# EAGLE design Auto_wiper (EAGLE 6.4)
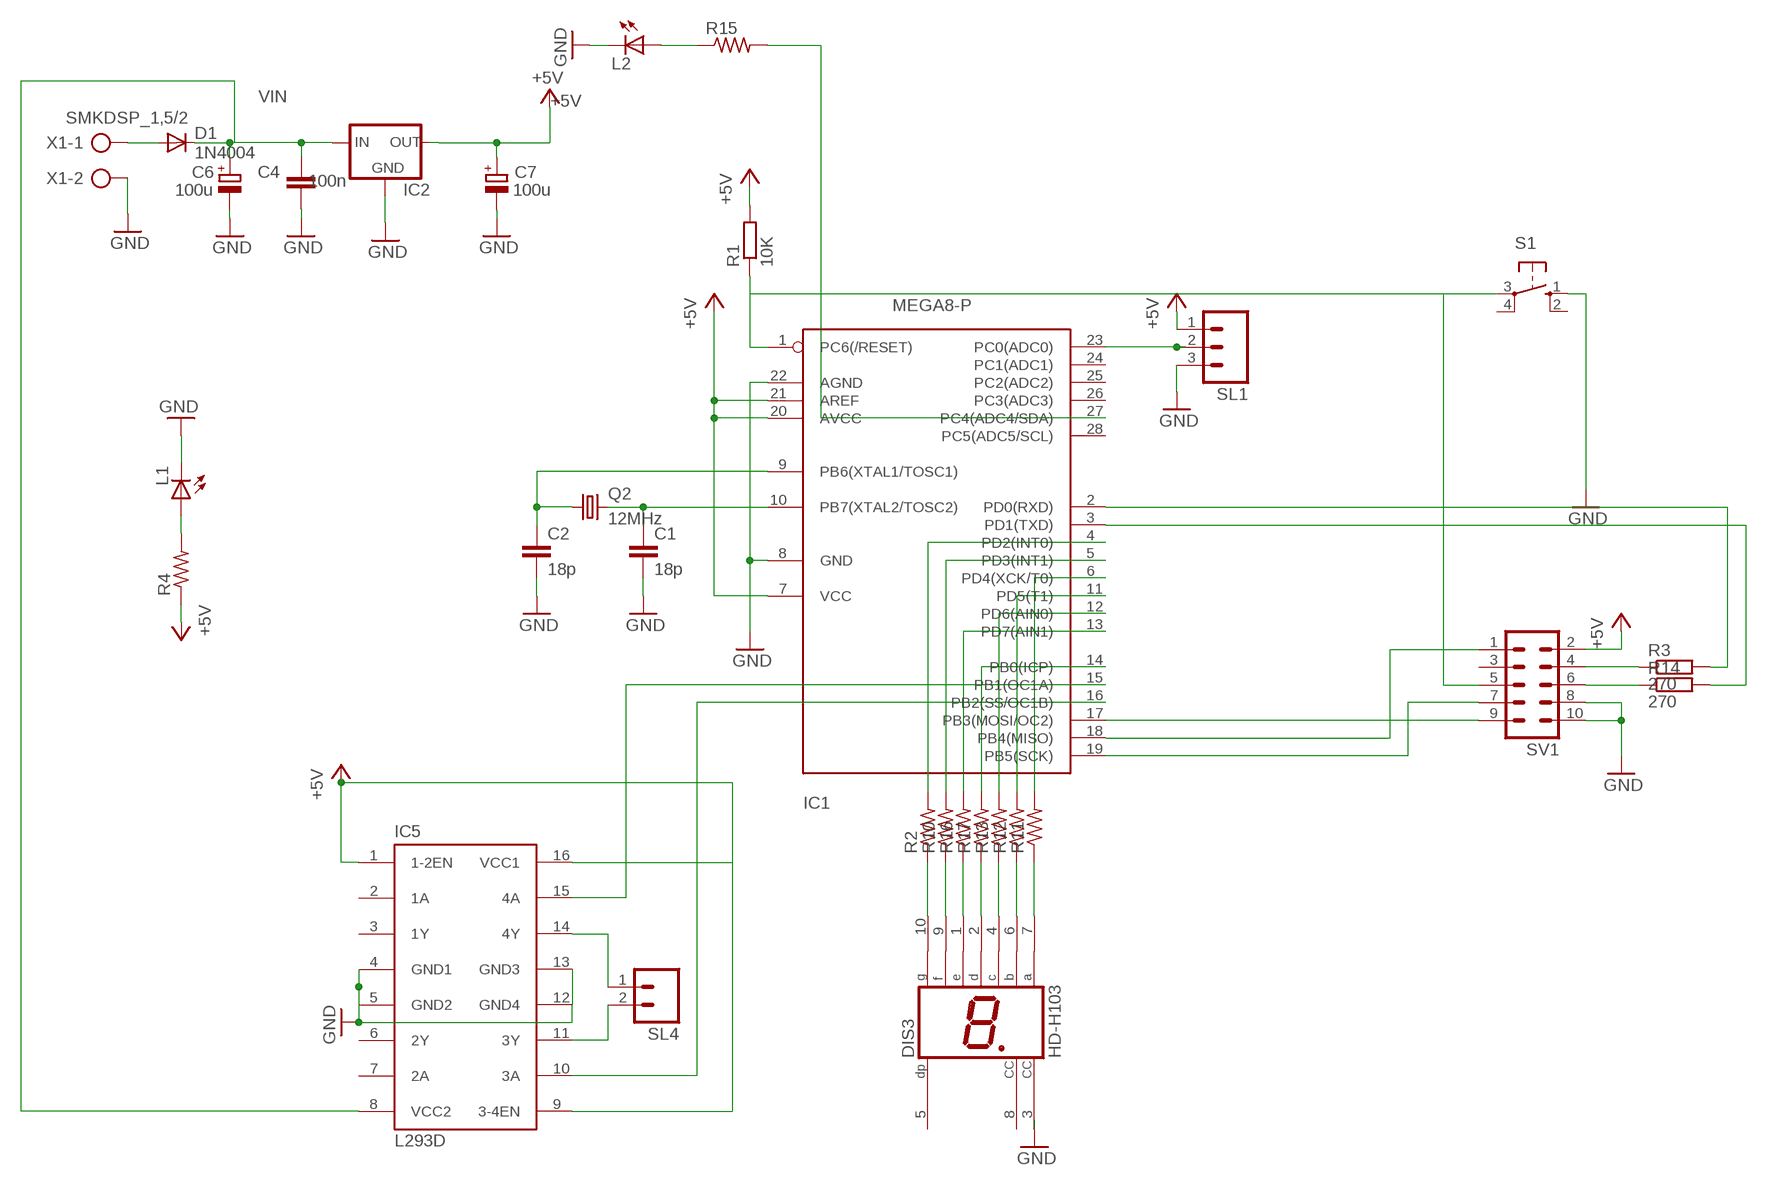
[diagram p0: schematic, sheet 1]

## Parts
C1  18p  C-EU025-024X044  [C025-024X044]
C2  18p  C-EU025-024X044  [C025-024X044]
C4  100n  C-EU025-030X050  [C025-030X050]
C6  100u  CPOL-EUE3.5-8  [E3,5-8]
C7  100u  CPOL-EUE3.5-8  [E3,5-8]
D1  1N4004  [DO41-10]
DIS3  HD-H103  [HDSP-M]
IC1  MEGA8-P  [DIL28-3]
IC2  78XXS  [78XXS]
IC5  L293D  [DIL16]
L1  LED5MM  [LED5MM]
L2  LED5MM  [LED5MM]
Q2  12MHz  CRYTALHC49S  [HC49/S]
R1  10K  R-EU_0207/10  [0207/10]
R2  R-US_0207/10  [0207/10]
R3  270  R-EU_0207/10  [0207/10]
R4  R-US_0207/10  [0207/10]
R10  R-US_0207/10  [0207/10]
R11  R-US_0207/10  [0207/10]
R12  R-US_0207/10  [0207/10]
R13  R-US_0207/10  [0207/10]
R14  270  R-EU_0207/10  [0207/10]
R15  R-US_0207/10  [0207/10]
R16  R-US_0207/10  [0207/10]
R17  R-US_0207/10  [0207/10]
S1  10-XX  [B3F-10XX]
SL1  M03  [03P]
SL4  M02  [02P]
SV1  ML10  [ML10]
X1  SMKDSP_1,5/2  [SMKDSP_1,5/2]

## Nets
+5V: C7.+ IC1.7(VCC) IC1.20(AVCC) IC1.21(AREF) IC2.OUT IC5.1(1-2EN) IC5.9(3-4EN) IC5.16(VCC1) R1.2 R4.1 SL1.1 SV1.2
GND: C1.2 C2.2 C4.1 C6.- C7.- DIS3.3(CC) IC1.8(GND) IC1.22(AGND) IC2.GND IC5.4(GND1) IC5.5(GND2) IC5.12(GND4) IC5.13(GND3) L1.K(C) L2.K(C) S1.1(S) SL1.3 SV1.8 SV1.10 X1.2
MOTOR1: IC1.15(PB1(OC1A)) IC5.15(4A)
MOTOR9: IC1.17(PB3(MOSI/OC2)) SV1.9
N$1: L1.A R4.2
N$2: IC1.19(PB5(SCK)) SV1.7
N$3: C1.1 IC1.10(PB7(XTAL2/TOSC2)) Q2.2
N$4: C2.1 IC1.9(PB6(XTAL1/TOSC1)) Q2.1
N$5: DIS3.10(G) R2.1
N$6: R3.1 SV1.4
N$7: IC1.2(PD0(RXD)) R3.2
N$8: IC1.3(PD1(TXD)) R14.2
N$9: DIS3.9(F) R10.1
N$10: IC1.27(PC4(ADC4/SDA)) R15.2
N$11: IC1.18(PB4(MISO)) SV1.1
N$12: DIS3.6(B) R12.1
N$13: IC1.1(PC6(/RESET)) R1.1 S1.3(P) SV1.5
N$14: DIS3.1(E) R16.1
N$15: DIS3.4(C) R13.1
N$16: DIS3.2(D) R17.1
N$17: DIS3.7(A) R11.1
N$18: IC1.11(PD5(T1)) R12.2
N$19: IC1.6(PD4(XCK/T0)) R11.2
N$20: IC1.5(PD3(INT1)) R10.2
N$21: IC1.4(PD2(INT0)) R2.2
N$22: IC1.23(PC0(ADC0)) SL1.2
N$23: IC1.16(PB2(SS/OC1B)) IC5.10(3A)
N$27: R14.1 SV1.6
N$30: L2.A R15.1
N$34: IC1.14(PB0(ICP)) R17.2
N$35: IC1.12(PD6(AIN0)) R13.2
N$36: IC1.13(PD7(AIN1)) R16.2
N$39: IC5.14(4Y) SL4.1
N$40: IC5.11(3Y) SL4.2
PWRIN [power]: D1.A X1.1
VIN [power]: C4.2 C6.+ D1.C IC2.IN IC5.8(VCC2)
Unconnected: DIS3.5(DP) DIS3.8(CC) IC1.24(PC1(ADC1)) IC1.25(PC2(ADC2)) IC1.26(PC3(ADC3)) IC1.28(PC5(ADC5/SCL)) IC5.2(1A) IC5.3(1Y) IC5.6(2Y) IC5.7(2A) S1.2(S1) S1.4(P1) SV1.3

## Library data of the parts
C1 C2 = rcl:C-EU: CAPACITOR, European symbol
C4 = resistor:C-EU: CAPACITOR, European symbol
C6 C7 = resistor:CPOL-EU: POLARIZED CAPACITOR, European symbol
D1 = diode:1N4004: DIODE general purpose rectifier, 1 A
DIS3 = display-hp:HD-H103: LED DISPLAY 1-character 7 segment, decimal point right; OC_FARNELL: unknown; OC_NEWARK: unknown
IC1 = atmel:MEGA8-P: MICROCONTROLLER 8 Kbytes FLASH 1 kbytes SRAM 512 bytes EEPROM USART 4-channel 10 bit ADC 2-channel 8 bit ADC Source: avr.lbr
IC2 = v-reg:78XXS: VOLTAGE REGULATOR
IC5 = st-microelectronics:L293D: PUSH-PULL 4 CHANNEL DRIVER; MPN: L293D; OC_FARNELL: 9589619; OC_NEWARK: 56P8249
L1 L2 = led:LED: LED OSRAM: - CHIPLED LG R971, LG N971, LY N971, LG Q971, LY Q971, LO R971, LY R971 LH N974, LH R974 LS Q976, LO Q976, LY Q976 LO Q996 - Hyper CHIPLED LW Q18S LB Q993, LB Q99A, LB R99A - SideLED LS A670, LO A670, LY A670, LG A670, LP A670 LB A673, LV A673, LT A673, LW A673 LH A674 LY A675 LS A676, LA A676, LO A676, LY A676, LW A676 LS A679, LY A679, LG A679 - Hyper Micro SIDELED® LS Y876, LA Y876, LO Y876, LY Y876 LT Y87S - SmartLED LW L88C, LW L88S LB L89C, LB L89S, LG L890 LS L89K, LO L89K, LY L89K LS L896, LA L896, LO L896, LY L896 - TOPLED LS T670, LO T670, LY T670, LG T670, LP T670 LSG T670, LSP T670, LSY T670, LOP T670, LYG T670 LG T671, LOG T671, LSG T671 LB T673, LV T673, LT T673, LW T673 LH T674 LS T676, LA T676, LO T676, LY T676, LB T676, LH T676, LSB T676, LW T676 LB T67C, LV T67C, LT T67C, LS T67K, LO T67K, LY T67K, LW E67C LS E67B, LA E67B, LO E67B, LY E67B, LB E67C, LV E67C, LT E67C LW T67C LS T679, LY T679, LG T679 LS T770, LO T770, LY T770, LG T770, LP T770 LB T773, LV T773, LT T773, LW T773 LH T774 LS E675, LA E675, LY E675, LS T675 LS T776, LA T776, LO T776, LY T776, LB T776 LHGB T686 LT T68C, LB T68C - Hyper Mini TOPLED® LB M676 - Mini TOPLED Santana® LG M470 LS M47K, LO M47K, LY M47K Source: http://www.osram.convergy.de LUXEON: - LUMILED® LXK2-PW12-R00, LXK2-PW12-S00, LXK2-PW14-U00, LXK2-PW14-V00 LXK2-PM12-R00, LXK2-PM12-S00, LXK2-PM14-U00 LXK2-PE12-Q00, LXK2-PE12-R00, LXK2-PE12-S00, LXK2-PE14-T00, LXK2-PE14-U00 LXK2-PB12-K00, LXK2-PB12-L00, LXK2-PB12-M00, LXK2-PB14-N00, LXK2-PB14-P00, LXK2-PB14-Q00 LXK2-PR12-L00, LXK2-PR12-M00, LXK2-PR14-Q00, LXK2-PR14-R00 LXK2-PD12-Q00, LXK2-PD12-R00, LXK2-PD12-S00 LXK2-PH12-R00, LXK2-PH12-S00 LXK2-PL12-P00, LXK2-PL12-Q00, LXK2-PL12-R00 Source: www.luxeon.com KINGBRIGHT: KA-3528ASYC Source: www.kingbright.com
Q2 = crystal:CRYTAL: CRYSTAL
R1 R3 R14 = rcl:R-EU_: RESISTOR, European symbol
R2 R4 R10-R13 R15-R17 = resistor:R-US_: RESISTOR, American symbol
S1 = switch-omron:10-XX: OMRON SWITCH; MPN: B3F-1000; OC_FARNELL: 176432; OC_NEWARK: 36M3542
SL1 = con-amp-quick:M03: AMP QUICK CONNECTOR; OC_FARNELL: unknown; OC_NEWARK: unknown
SL4 = con-amp-quick:M02: AMP QUICK CONNECTOR; OC_FARNELL: unknown; OC_NEWARK: unknown
SV1 = con-harting-ml:ML10: HARTING
X1 = con-phoenix-smkdsp:SMKDSP_1,5/2: Printklemme, Nennstrom: 17,5 A, Bemessungsspannung: 250 V, Raster: 5,0 mm Source: http://eshop.phoenixcontact.de .. 1733415.pdf; MF: FARNELL; MPN: 1733570; OC_FARNELL: 3041244; OC_NEWARK: 69C8588

## Net classes
0 default: width 0.254 mm, drill 0.305 mm, clearance 0.152 mm
1 power: width 0.61 mm, drill 0.508 mm, clearance 0.152 mm
2 gnd: width 0.305 mm, drill 0.508 mm, clearance 0.152 mm
3 usbvcc: width 0.508 mm, drill 0.508 mm, clearance 0.152 mm

## Board
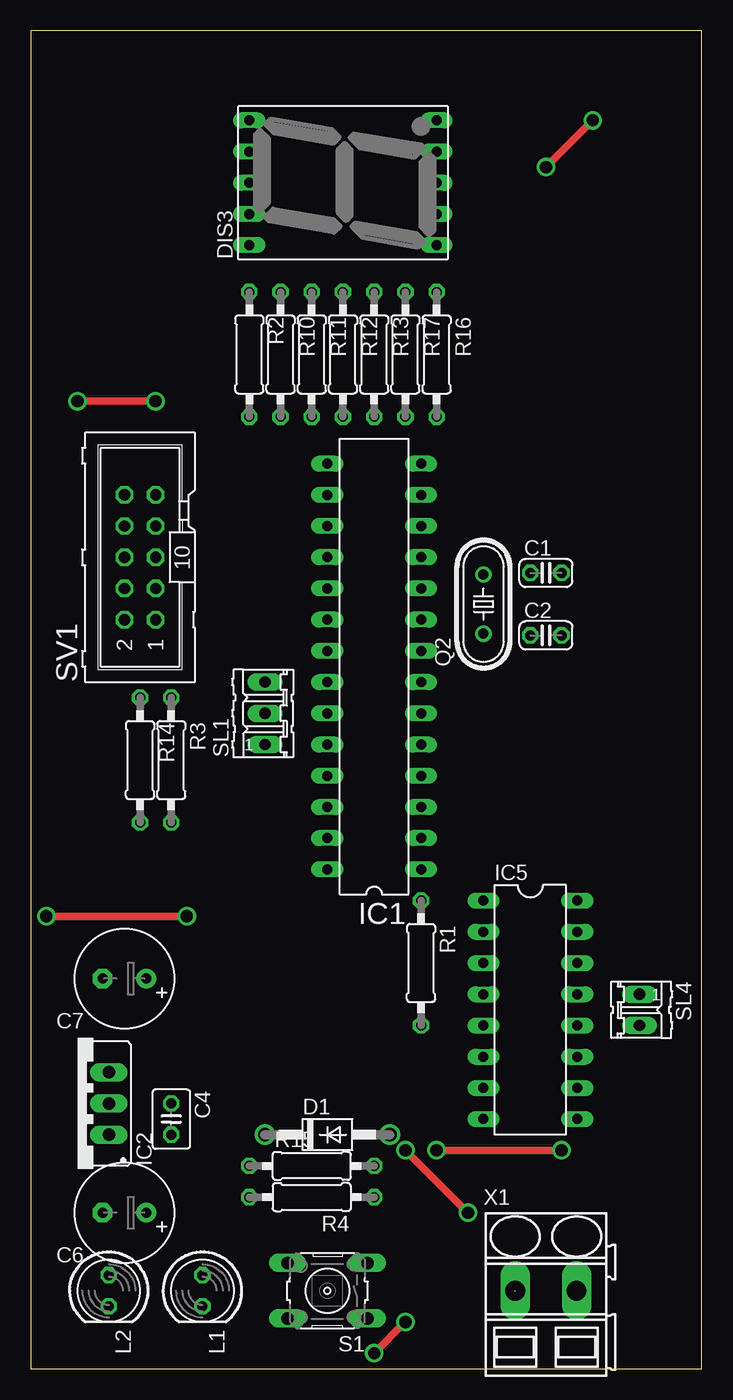
[diagram p1: board, top side]
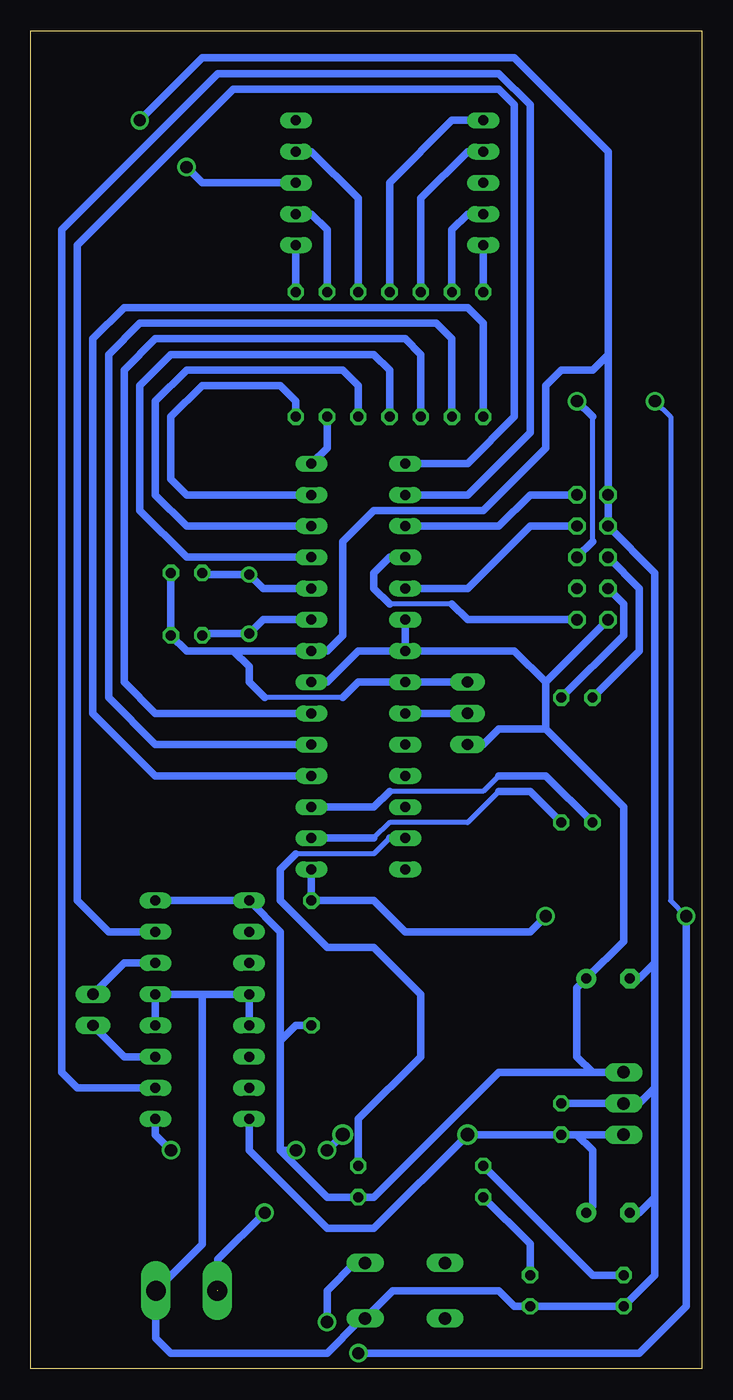
[diagram p2: board, bottom side, seen from below]

Size 54.59 x 108.89 mm. Coordinates in mm from the lower left corner, seen from the top.
Outline: 0,0 54.59,0 54.59,108.89 0,108.89 0,0
Copper layers (1*16): Top 0.035mm / dielectric 1.5mm / Bottom 0.035mm
Design rules "default": minimum track width 10mil, minimum drill 24mil, track to track 8mil, track to pad 8mil, pad to pad 8mil, via to via 8mil, smd to smd 8mil, copper to edge 40mil, drill to drill 8mil, minimum pad ring 10mil, minimum via ring 8mil, stop-mask expansion 4mil, vias tented up to drill 0mil, thermal gap 10mil

### Footprints (pad centres in the part's own frame; a part is rotated, then mirrored left to right if it is on the bottom)
C025-024X044 = drill 0.813 octagon: 1 -1.27,0; 2 1.27,0
C025-030X050 = drill 0.813 octagon: 1 -1.27,0; 2 1.27,0
E3,5-8 = drill 0.813 pad 1.6: + -1.778,0 | drill 0.813 pad 1.6 octagon: - 1.778,0
DO41-10 = drill 1.118: A 5.08,0; C -5.08,0
HDSP-M = drill 0.813 long: 1 -5.08,-7.62; 2 -2.54,-7.62; 3 0,-7.62; 4 2.54,-7.62; 5 5.08,-7.62; 6 5.08,7.62; 7 2.54,7.62; 8 0,7.62; 9 -2.54,7.62; 10 -5.08,7.62
DIL28-3 = drill 0.813 long: 1 -16.51,-3.81; 2 -13.97,-3.81; 3 -11.43,-3.81; 4 -8.89,-3.81; 5 -6.35,-3.81; 6 -3.81,-3.81; 7 -1.27,-3.81; 8 1.27,-3.81; 9 3.81,-3.81; 10 6.35,-3.81; 11 8.89,-3.81; 12 11.43,-3.81; 13 13.97,-3.81; 14 16.51,-3.81; 15 16.51,3.81; 16 13.97,3.81; 17 11.43,3.81; 18 8.89,3.81; 19 6.35,3.81; 20 3.81,3.81; 21 1.27,3.81; 22 -1.27,3.81; 23 -3.81,3.81; 24 -6.35,3.81; 25 -8.89,3.81; 26 -11.43,3.81; 27 -13.97,3.81; 28 -16.51,3.81
78XXS = drill 1.016 long: GND 0,-2.54; IN -2.54,-2.54; OUT 2.54,-2.54
DIL16 = drill 0.813 long: 1 -8.89,-3.81; 2 -6.35,-3.81; 3 -3.81,-3.81; 4 -1.27,-3.81; 5 1.27,-3.81; 6 3.81,-3.81; 7 6.35,-3.81; 8 8.89,-3.81; 9 8.89,3.81; 10 6.35,3.81; 11 3.81,3.81; 12 1.27,3.81; 13 -1.27,3.81; 14 -3.81,3.81; 15 -6.35,3.81; 16 -8.89,3.81
LED5MM = drill 0.813 octagon: A -1.27,0; K 1.27,0
HC49/S = drill 0.813: 1 -2.413,0; 2 2.413,0
0207/10 = drill 0.813 octagon: 1 -5.08,0; 2 5.08,0
B3F-10XX = drill 1.016 long: 1 -3.251,2.261; 2 3.251,2.261; 3 -3.251,-2.261; 4 3.251,-2.261
03P = drill 0.914 long: 1 -2.54,0; 2 0,0; 3 2.54,0
02P = drill 0.914 long: 1 -1.27,0; 2 1.27,0
ML10 = drill 0.914 octagon: 1 -5.08,-1.27; 2 -5.08,1.27; 3 -2.54,-1.27; 4 -2.54,1.27; 5 0,-1.27; 6 0,1.27; 7 2.54,-1.27; 8 2.54,1.27; 9 5.08,-1.27; 10 5.08,1.27
SMKDSP_1,5/2 = drill 1.6 pad 1.8 long: 1 -2.5,0; 2 2.5,0

### Placement (x,y rotation side)
C1  41.91,64.77 0 top
C2  41.91,59.69 0 top
C4  11.43,20.32 270 top
C6  7.62,12.7 180 top
C7  7.62,31.75 180 top
D1  24.13,19.05 0 top
DIS3  25.4,96.52 90 top
IC1  27.94,57.15 90 top
IC2  3.81,21.59 90 top
IC5  40.64,29.21 270 top
L1  13.97,6.35 270 top
L2  6.35,6.35 270 top
Q2  36.83,62.23 90 top
R1  31.75,33.02 270 top
R2  17.78,82.55 270 top
R3  11.43,49.53 270 top
R4  22.86,13.97 180 top
R10  20.32,82.55 270 top
R11  22.86,82.55 270 top
R12  25.4,82.55 270 top
R13  27.94,82.55 270 top
R14  8.89,49.53 270 top
R15  22.86,16.51 0 top
R16  33.02,82.55 270 top
R17  30.48,82.55 270 top
S1  24.13,6.35 180 top
SL1  19.05,53.34 90 top
SL4  49.53,29.21 270 top
SV1  8.89,66.04 90 top
X1  41.91,6.35 0 top

### Tracks (layer width: path | path; a pad name or v marks a point on that pad's centre or on a via)
+5V  (via drill 1)
  Top 0.61: v43.18,17.78 v33.02,17.78
  Bottom 0.61: SV1.2 12.7,55.88 | 12.7,55.88 12.7,52.07 | 12.7,52.07 6.35,45.72 6.35,34.8 C7.+ 10.16,30.99 10.16,25.4 8.89,24.13 IC2.OUT 16.51,24.13 26.67,13.97 R4.1 30.48,13.97 34.29,17.78 | IC1.21 IC1.20 | IC1.21 15.24,58.42 12.7,55.88 | IC1.7 30.48,55.88 27.94,58.42 IC1.21 | IC5.16 IC5.1 34.29,35.56 34.29,26.67 | 34.29,17.78 34.29,26.67 | R1.2 33.02,27.94 34.29,26.67 | IC5.9 44.45,19.05 v43.18,17.78 | v33.02,17.78 34.29,17.78 | 12.7,52.07 16.51,52.07 17.78,50.8 SL1.1
GND  (via drill 1)
  Top 0.61: v41.91,97.79 v45.72,101.6
  Bottom 0.406: 29.21,54.61 35.56,54.61
  Bottom 0.61: C1.2 C2.2 41.91,58.42 38.1,58.42 | 38.1,58.42 IC1.8 30.48,58.42 29.21,59.69 29.21,67.31 26.67,69.85 17.78,69.85 12.7,74.93 12.7,80.01 11.43,81.28 8.89,81.28 7.62,82.55 | C4.1 IC2.GND 5.08,21.59 3.81,22.86 | 29.21,54.61 27.94,55.88 IC1.22 SL1.3 | 35.56,54.61 36.83,55.88 36.83,57.15 38.1,58.42 | 34.29,96.52 DIS3.3 40.64,96.52 v41.91,97.79 | IC5.5 IC5.4 40.64,30.48 | IC5.12 IC5.13 40.64,30.48 | 40.64,30.48 40.64,10.12 X1.2 44.41,2.5 43.18,1.27 30.48,1.27 27.94,3.81 27.66,3.81 S1.1 25.12,6.35 16.51,6.35 15.24,5.08 L1.K L2.K 3.81,7.62 3.81,13.97 | v45.72,101.6 40.64,106.68 15.24,106.68 7.62,99.06 7.62,82.55 | 7.62,82.55 SV1.10 SV1.8 3.81,64.77 3.81,33.02 | 3.81,13.97 3.81,22.86 | 3.81,22.86 3.81,33.02 | C7.- 5.08,31.75 3.81,33.02 | C6.- 5.08,12.7 3.81,13.97
MOTOR1
  Bottom 0.61: IC1.15 19.05,73.66 15.24,77.47 15.24,102.87 16.51,104.14 38.1,104.14 50.8,91.44 50.8,38.1 48.26,35.56 IC5.15
MOTOR9
  Bottom 0.61: SV1.9 13.97,71.12 16.51,68.58 IC1.17
N$1
  Bottom 0.61: L1.A 13.97,10.16 R4.2
N$2
  Bottom 0.61: IC1.19 19.05,63.5 13.97,68.58 SV1.7
N$3
  Bottom 0.61: IC1.10 35.69,63.5 Q2.2 40.51,64.64 C1.1
N$4
  Bottom 0.61: IC1.9 35.69,60.96 Q2.1 40.51,59.82 C2.1
N$5
  Bottom 0.61: R2.1 DIS3.10
N$6
  Bottom 0.61: SV1.4 6.35,62.23 6.35,59.69 R3.1
N$7
  Bottom 0.406: 16.51,46.99 19.05,44.45 25.4,44.45 26.67,43.18
  Bottom 0.61: R3.2 13.97,46.99 16.51,46.99 | 26.67,43.18 IC1.2
N$8
  Bottom 0.406: 16.51,48.26 17.78,46.99 25.4,46.99
  Bottom 0.61: IC1.3 26.67,45.72 25.4,46.99 | 16.51,48.26 12.7,48.26 R14.2
N$9
  Bottom 0.61: DIS3.9 19.05,93.98 20.32,92.71 R10.1
N$10
  Bottom 0.406: 25.4,43.18 26.67,41.91 33.02,41.91
  Bottom 0.61: IC1.27 25.4,43.18 | R15.2 27.94,20.32 22.86,25.4 22.86,30.48 26.67,34.29 30.48,34.29 34.29,38.1 34.29,40.64 33.02,41.91
N$11
  Bottom 0.406: 20.32,62.23 25.4,62.23
  Bottom 0.61: SV1.1 19.05,60.96 20.32,62.23 | 25.4,62.23 26.67,63.5 26.67,64.77 25.4,66.04 IC1.18
N$12
  Bottom 0.61: DIS3.6 20.32,101.6 25.4,96.52 R12.1
N$13  (via drill 1)
  Top 0.61: v10.16,78.74 v3.81,78.74 | v1.27,36.83 v12.7,36.83 | v30.48,3.81 v27.94,1.27
  Bottom 0.406: 8.89,67.31 8.89,77.47 | v1.27,36.83 2.54,38.1 2.54,77.47 v3.81,78.74
  Bottom 0.61: IC1.1 R1.1 30.48,38.1 29.21,38.1 26.67,38.1 24.13,35.56 13.97,35.56 v12.7,36.83 | SV1.5 8.89,67.31 | 8.89,77.47 v10.16,78.74 | S1.3 28.22,8.61 30.48,6.35 v30.48,3.81 | v27.94,1.27 5.08,1.27 1.27,5.08 v1.27,36.83
N$14
  Bottom 0.61: R16.1 DIS3.1
N$15
  Bottom 0.61: R13.1 27.94,95.25 31.75,99.06 DIS3.4
N$16
  Bottom 0.61: R17.1 30.48,92.71 31.75,93.98 DIS3.2
N$17
  Bottom 0.61: DIS3.7 19.05,99.06 22.86,95.25 R11.1
N$18
  Bottom 0.61: R12.2 25.4,81.28 26.67,82.55 43.18,82.55 45.72,80.01 45.72,69.85 41.91,66.04 IC1.11
N$19
  Bottom 0.61: R11.2 22.86,82.55 24.13,83.82 44.45,83.82 46.99,81.28 46.99,55.88 44.45,53.34 IC1.6
N$20
  Bottom 0.61: IC1.5 44.45,50.8 48.26,54.61 48.26,82.55 45.72,85.09 21.59,85.09 20.32,83.82 R10.2
N$21
  Bottom 0.61: R2.2 17.78,85.09 19.05,86.36 46.99,86.36 49.53,83.82 49.53,53.34 44.45,48.26 IC1.4
N$22
  Bottom 0.61: IC1.23 SL1.2
N$23
  Bottom 0.61: IC1.16 19.05,71.12 13.97,76.2 13.97,102.87 16.51,105.41 39.37,105.41 52.07,92.71 52.07,24.13 50.8,22.86 IC5.10
N$27
  Bottom 0.61: SV1.6 5.08,63.5 5.08,58.42 R14.1
N$30
  Bottom 0.61: L2.A 8.89,7.62 R15.1
N$34
  Bottom 0.61: IC1.14 30.48,74.93 R17.2
N$35
  Bottom 0.61: IC1.12 41.91,68.58 44.45,71.12 44.45,78.74 41.91,81.28 29.21,81.28 27.94,80.01 R13.2
N$36
  Bottom 0.61: R16.2 33.02,78.74 34.29,80.01 40.64,80.01 43.18,77.47 43.18,72.39 41.91,71.12 IC1.13
N$39
  Bottom 0.61: IC5.14 46.99,33.02 SL4.1
N$40
  Bottom 0.61: IC5.11 46.99,25.4 SL4.2
PWRIN  (via drill 1)  (1 unrouted)
  Top 0.61: v30.48,17.78 v35.56,12.7
  Bottom 0.61: D1.A v30.48,17.78 | v35.56,12.7 39.37,8.89 39.37,6.35
VIN
  Bottom 0.61: IC2.IN C4.2 | C4.2 D1.C 26.67,11.43 30.48,11.43 36.83,17.78 IC5.8 | C4.2 10.16,19.05 8.89,17.78 8.89,13.21 C6.+